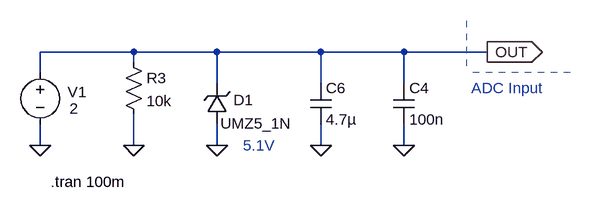
[diagram p0: schematic v1.0.asc]
v1.0.asc, the LTspice schematic file:
Version 4.1
SHEET 1 1508 680
WIRE -144 128 -288 128
WIRE -16 128 -144 128
WIRE 144 128 -16 128
WIRE 272 128 144 128
WIRE 400 128 272 128
WIRE -144 144 -144 128
WIRE -288 160 -288 128
WIRE -16 176 -16 128
WIRE 144 176 144 128
WIRE 272 176 272 128
WIRE -288 272 -288 240
WIRE -144 272 -144 224
WIRE -16 272 -16 240
WIRE 144 272 144 240
WIRE 272 272 272 240
FLAG -288 272 0
FLAG 400 128 OUT
IOPIN 400 128 Out
FLAG 272 272 0
FLAG -144 272 0
FLAG 144 272 0
FLAG -16 272 0
SYMBOL voltage -288 144 R0
WINDOW 0 42 46 Left 2
WINDOW 3 59 71 Right 2
WINDOW 123 0 0 Left 0
WINDOW 39 0 0 Left 0
SYMATTR InstName V1
SYMATTR Value 2
SYMBOL cap 256 176 R0
SYMATTR InstName C4
SYMATTR Value 100n
SYMBOL res -160 128 R0
SYMATTR InstName R3
SYMATTR Value 10k
SYMBOL cap 128 176 R0
SYMATTR InstName C6
SYMATTR Value 4.7µ
SYMBOL zener 0 240 R180
WINDOW 0 -40 38 Left 2
WINDOW 3 -100 2 Left 2
SYMATTR InstName D1
SYMATTR Value UMZ5_1N
TEXT -272 328 Left 2 !.tran 100m
TEXT 376 184 Left 2 ;ADC Input
TEXT 24 272 Left 2 ;5.1V
LINE Normal 528 160 368 160 2
LINE Normal 368 80 368 160 2

The netlist it stands for:
* v1.0.asc
V1 OUT 0 2
C4 OUT 0 100n
R3 OUT 0 10k
C6 OUT 0 4.7µ
D1 0 OUT UMZ5_1N
.model D D
.lib standard.dio
.tran 100m
* ADC Input
* 5.1V
.backanno
.end

* Results of the author's LTspice run, read from the files saved beside the schematic
* Operating Point, zero values left out:
*   V(out) = 2 V
*   I(D1) = -444.9 pA
*   I(R3) = 200 µA
*   I(V1) = -200 µA
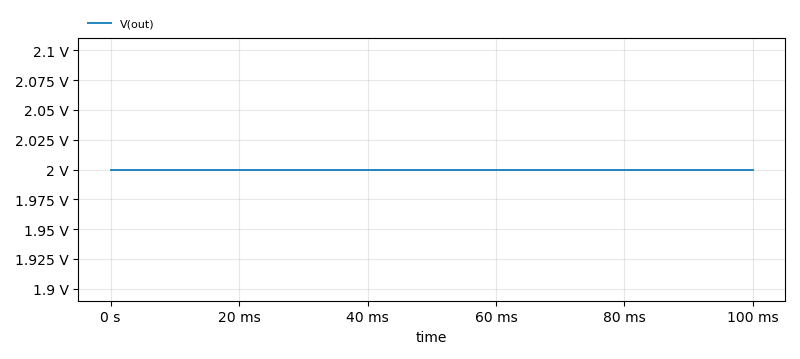
[diagram p1: Transient Analysis of v1.0.asc, plotted from the saved traces]
* Transient Analysis, 1 run:
*   V(out): min 2 V, max 2 V, average 2 V, rms 2 V, last 2 V